# Altium project Accelerometer.PrjPcb
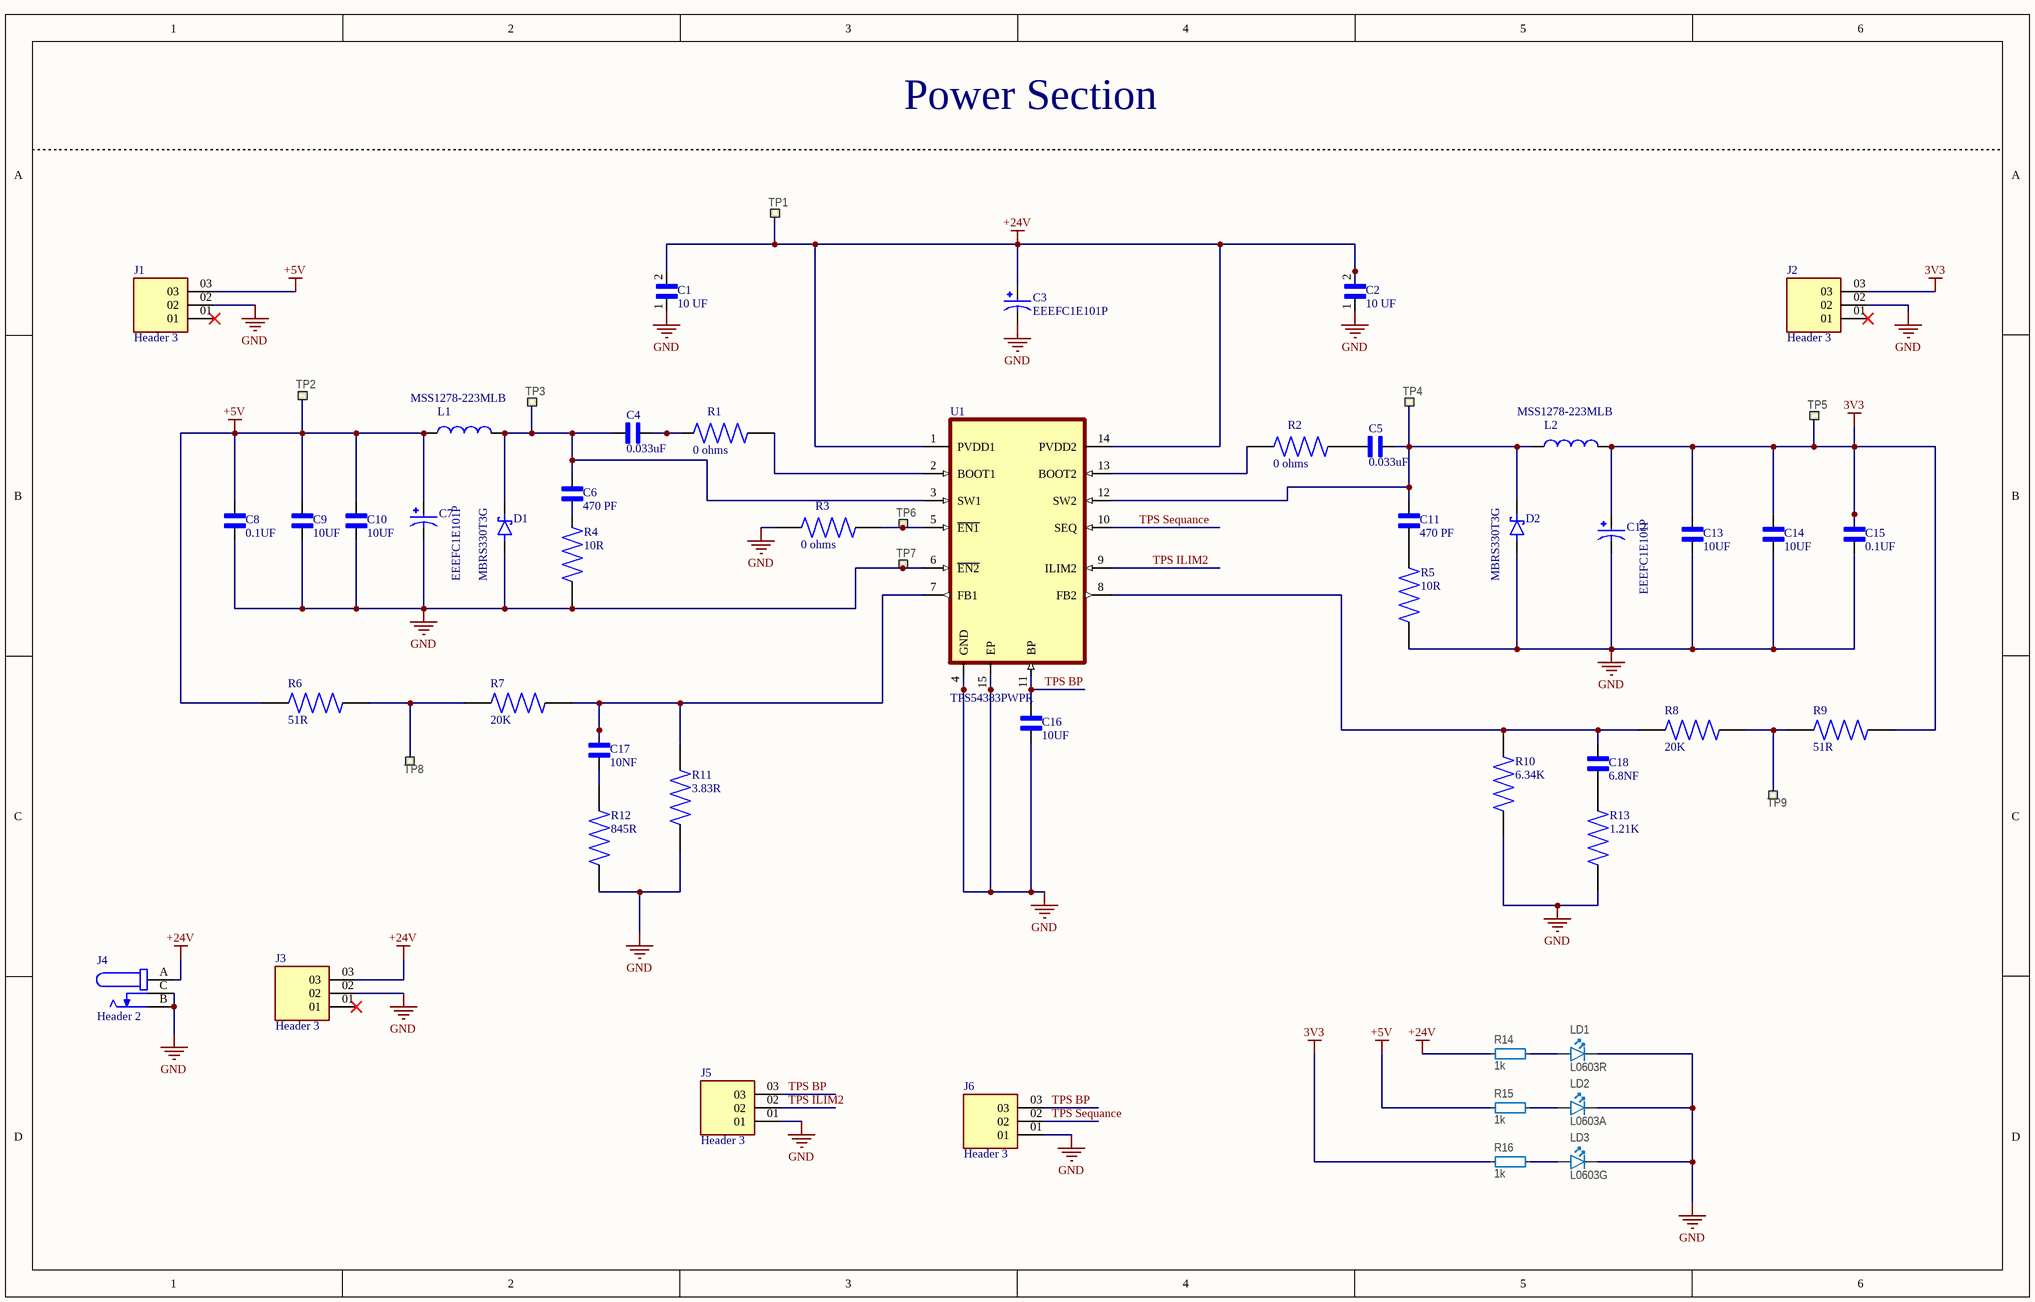
[diagram p0: Power section.SchDoc]
3 sheets, 128 parts. Net scope: global (net labels, ports and power ports of the same name join across sheets).
Board file: Accelero.PcbDoc
Sheets:
  Power section.SchDoc
  MCU.SchDoc
  Sheet1.SchDoc

## Sheet Power section.SchDoc
size 381 x 241 mm; SheetNumber: 1; SheetTotal: 3

### Parts
C1  10 UF  [CAPC3216X180N]
C2  10 UF  [CAPC3216X180N]
C3  EEEFC1E101P  [CAP_EEEFC1E101P]
C4  0.033uF  [CAPC1608X90]
C5  0.033uF  [CAPC1608X90]
C6  470 PF  [CAPC1608X90]
C7  EEEFC1E101P  [CAP_EEEFC1E101P]
C8  0.1UF  [CAPC1608X90]
C9  10UF  [CAPC2012X140N]
C10  10UF  [CAPC2012X140N]
C11  470 PF  [CAPC1608X90]
C12  EEEFC1E101P  [CAP_EEEFC1E101P]
C13  10UF  [CAPC2012X140N]
C14  10UF  [CAPC2012X140N]
C15  0.1UF  [CAPC1608X90]
C16  10UF  [CAPC2012X140N]
C17  10NF  [CAPC1608X90]
C18  6.8NF  [CAPC1608X90]
D1  MBRS330T3G  [DIOM7959X261N]
D2  MBRS330T3G  [DIOM7959X261N]
J1  Header 3  [SAMTEC_HMTSW-103-XX-X-S-XXX]
J2  Header 3  [SAMTEC_HMTSW-103-XX-X-S-XXX]
J3  Header 3  [SAMTEC_HMTSW-103-XX-X-S-XXX]
J4  Header 2  [TENSILITY_54-00129]
J5  Header 3  [SAMTEC_HMTSW-103-XX-X-S-XXX]
J6  Header 3  [SAMTEC_HMTSW-103-XX-X-S-XXX]
L1  MSS1278-223MLB  [IND_MSS1278-223MLB]
L2  MSS1278-223MLB  [IND_MSS1278-223MLB]
LD1  L0603R  [LED_0603_R]
LD2  L0603A  [LED_0603_Y]
LD3  L0603G  [LED_0603_G]
R1  0 ohms  [RESC1608X55N]
R2  0 ohms  [RESC1608X55N]
R3  0 ohms  [RESC1608X55N]
R4  10R  [RESC1608X55N]
R5  10R  [RESC1608X55N]
R6  51R  [RESC1608X55N]
R7  20K  [RESC1608X55N]
R8  20K  [RESC1608X55N]
R9  51R  [RESC1608X55N]
R10  6.34K  [RESC1608X55N]
R11  3.83R  [RESC1608X55N]
R12  845R  [RESC1608X55N]
R13  1.21K  [RESC1608X55N]
R14  1k  [RESC0603X03L_C]
R15  1k  [RESC0603X03L_C]
R16  1k  [RESC0603X03L_C]
TP1  Ø0.7mm,SMD  [TP_SMD_D0.7mm]  (value not drawn)  (no BOM)
TP2  Ø0.7mm,SMD  [TP_SMD_D0.7mm]  (value not drawn)  (no BOM)
TP3  Ø0.7mm,SMD  [TP_SMD_D0.7mm]  (value not drawn)  (no BOM)
TP4  Ø0.7mm,SMD  [TP_SMD_D0.7mm]  (value not drawn)  (no BOM)
TP5  Ø0.7mm,SMD  [TP_SMD_D0.7mm]  (value not drawn)  (no BOM)
TP6  Ø0.7mm,SMD  [TP_SMD_D0.7mm]  (value not drawn)  (no BOM)
TP7  Ø0.7mm,SMD  [TP_SMD_D0.7mm]  (value not drawn)  (no BOM)
TP8  Ø0.7mm,SMD  [TP_SMD_D0.7mm]  (value not drawn)  (no BOM)
TP9  Ø0.7mm,SMD  [TP_SMD_D0.7mm]  (value not drawn)  (no BOM)
U1  TPS54383PWPR  [IC_TPS27S100BPWPR]

### Nets
3V3: C12.1 C13.1 C14.1 C15.1 J2.03 L2.2 R9.1 R16.1 TP5.1
+5V: C7.1 C8.1 C9.1 C10.1 J1.03 L1.1 R6.2 R15.1 TP2.1
+24V: C1.2 C2.2 C3.1 J3.03 J4.A R14.1 TP1.1 U1.1(PVDD1) U1.14(PVDD2)
GND: C1.1 C2.1 C3.2 C7.2 C8.2 C9.2 C10.2 C12.2 C13.2 C14.2 C15.2 C16.2 D1.A D2.A J1.02 J2.02 J3.02 J4.B J4.C J5.01 J6.01 LD1.1(C) LD2.1(C) LD3.1(C) R3.1 R4.1 R5.1 R10.1 R11.1 R12.1 R13.1 TP7.1 U1.4(GND) U1.6(~{EN2}) U1.15(EP)
TPS BP: C16.1 J5.03 J6.03 U1.11(BP)
TPS ILIM2: J5.02 U1.9(ILIM2)
TPS Sequance: J6.02 U1.10(SEQ)
NetC4_1: C4.1 R1.1
NetC4_2: C4.2 C6.1 D1.C(K) L1.2 TP3.1 U1.3(SW1)
NetC5_1: C5.1 C11.1 D2.C(K) L2.1 TP4.1 U1.12(SW2)
NetC5_2: C5.2 R2.2
NetC6_2: C6.2 R4.2
NetC11_2: C11.2 R5.2
NetC17_1: C17.1 R7.1 R11.2 U1.7(FB1)
NetC17_2: C17.2 R12.2
NetC18_1: C18.1 R8.2 R10.2 U1.8(FB2)
NetC18_2: C18.2 R13.2
NetLD1_2: LD1.2(A) R14.2
NetLD2_2: LD2.2(A) R15.2
NetLD3_2: LD3.2(A) R16.2
NetR1_2: R1.2 U1.2(BOOT1)
NetR2_1: R2.1 U1.13(BOOT2)
NetR3_2: R3.2 TP6.1 U1.5(~{EN1})
NetR6_1: R6.1 R7.2 TP8.1
NetR8_1: R8.1 R9.2 TP9.1

Not connected (* = marked no-connect by the designer): J1 01*; J2 01*; J3 01*

### Notes on the sheet
- Power Section

### Library data of the parts
C1 C2 = C3216X5R1E106M160AB: 10µF Â±20% 25V Ceramic Capacitor 1206 (3216 Metric); MF: TDK; Check_prices: https://www.snapeda.com/parts/C3216X5R1E106M160AB/TDK/view-part/?ref=eda; Value: *; Digi-Key_Part_Number: 445-7708-2-ND; MP: C3216X5R1E106M160AB; Package: 3216 TDK; Purchase-URL: https://pricing.snapeda.com/search/part/C3216X5R1E106M160AB/?ref=eda; SnapEDA_Link: https://www.snapeda.com/parts/C3216X5R1E106M160AB/TDK/view-part/?ref=snap
C3 C7 C12 = EEEFC1E101P: Capacitor,Alum Electrolytic,Cap 100 uF,Tol 20%,Vol-Rtg 25 VDC,SMT,8x10.2,TR | Panasonic Electronic Components EEE-FC1E101P; SnapEDA_Link: https://www.snapeda.com/parts/EEE-FC1E101P/Panasonic+Electronic+Components/view-part/?ref=snap; Package: RADIAL-2 Panasonic; Value: *; MF: Panasonic; MP: EEE-FC1E101P; Check_prices: https://www.snapeda.com/parts/EEE-FC1E101P/Panasonic+Electronic+Components/view-part/?ref=eda
C4 C5 = C0603C104J3RACTU: Capacitor, ceramic, 25 V, X7R, 20%, .033 μF, 0603; MF: KEMET; SnapEDA_Link: https://www.snapeda.com/parts/C0603C104J3RACTU/KEMET/view-part/?ref=snap; Package: 603-2 KEMET; Value: *; MP: C0603C104J3RACTU; Check_prices: https://www.snapeda.com/parts/C0603C104J3RACTU/KEMET/view-part/?ref=eda
C6 C11 = C0603C104J3RACTU: Capacitor, ceramic, 25 V, X7R, 20%, 470 pF, 0603; MF: KEMET; SnapEDA_Link: https://www.snapeda.com/parts/C0603C104J3RACTU/KEMET/view-part/?ref=snap; Package: 603-2 KEMET; Value: *; MP: C0603C104J3RACTU; Check_prices: https://www.snapeda.com/parts/C0603C104J3RACTU/KEMET/view-part/?ref=eda
C8 C15 = C0603C104J3RACTU: Capacitor, ceramic, 10 V, X7R, 20%, 0.1 μF, 0603; MF: KEMET; SnapEDA_Link: https://www.snapeda.com/parts/C0603C104J3RACTU/KEMET/view-part/?ref=snap; Package: 603-2 KEMET; Value: *; MP: C0603C104J3RACTU; Check_prices: https://www.snapeda.com/parts/C0603C104J3RACTU/KEMET/view-part/?ref=eda
C9 C10 C13 C14 = 0805ZD474MAT2A: Capacitor, ceramic, 6.3 V, X5R, 20%, 10 μF, 0805; MF: AVX; SnapEDA_Link: https://www.snapeda.com/parts/0805ZD474MAT2A/AVX/view-part/?ref=snap; Package: 0805-2 AVX; Value: *; MP: 0805ZD474MAT2A; Check_prices: https://www.snapeda.com/parts/0805ZD474MAT2A/AVX/view-part/?ref=eda
C16 = 0805ZD474MAT2A: 0.47 ÂµF Â±20% 10V Ceramic Capacitor X5R 0805 (2012 Metric); MF: AVX; SnapEDA_Link: https://www.snapeda.com/parts/0805ZD474MAT2A/AVX/view-part/?ref=snap; Package: 0805-2 AVX; Value: *; MP: 0805ZD474MAT2A; Check_prices: https://www.snapeda.com/parts/0805ZD474MAT2A/AVX/view-part/?ref=eda
C17 C18 = C0603C104J3RACTU: 0603 C 100nF Ceramic Multilayer Capacitor, 25 V, +125degC, X7R Dielectric, +/-5% | KEMET C0603C104J3RACTU; SnapEDA_Link: https://www.snapeda.com/parts/C0603C104J3RACTU/KEMET/view-part/?ref=snap; Package: 603-2 KEMET; Value: *; MF: KEMET; MP: C0603C104J3RACTU; Check_prices: https://www.snapeda.com/parts/C0603C104J3RACTU/KEMET/view-part/?ref=eda
D1 D2 = MBRS330T3G: Diode Schottky 30 V 3A Surface Mount SMC; MF: ON Semiconductor; SnapEDA_Link: https://www.snapeda.com/parts/MBRS330T3G/Onsemi/view-part/?ref=snap; Package: SMC-2 ON Semiconductor; Value: *; MP: MBRS330T3G; Check_prices: https://www.snapeda.com/parts/MBRS330T3G/Onsemi/view-part/?ref=eda
J1-J3 J5 J6 = HMTSW-103-XX-X-S-XXX: Connector Unshrouded Header 3 Position 2.54mm Solder Straight Through Hole; MF: Samtec; MP: HMTSW-103-10-T-S-330; SnapEDA_Link: https://www.snapeda.com/parts/HMTSW-103-10-T-S-330/Samtec/view-part/?ref=snap; Package: None; Value: *; Check_prices: https://www.snapeda.com/parts/HMTSW-103-10-T-S-330/Samtec/view-part/?ref=eda
J4 = 54-00129: Connector, dc jack 5.5x2.1 mm, PCB mount, 90 degrees, silver plated, thru hole; MF: Tensility International Corp; Package: None; Price: None; Check_prices: https://www.snapeda.com/parts/54-00129/Tensility+International+Corp/view-part/?ref=eda; Value: *; SnapEDA_Link: https://www.snapeda.com/parts/54-00129/Tensility+International+Corp/view-part/?ref=snap; MP: 54-00129; Availability: In Stock; Purchase-URL: https://pricing.snapeda.com/search?q=54-00129&ref=eda
L1 L2 = MSS1278-223MLB: Fixed Inductors 22uH Shld 20% 4A 39.5mOhms AECQ2; MF: Coilcraft; SnapEDA_Link: https://www.snapeda.com/parts/MSS1278-223MLB/Coilcraft/view-part/?ref=snap; Package: None; Value: *; MP: MSS1278-223MLB; Check_prices: https://www.snapeda.com/parts/MSS1278-223MLB/Coilcraft/view-part/?ref=eda
LD1 = ASMT-RR45-AQ902: LED, Red, 0603, Vf=2V, - 40 to +100°C; Manufacturer: Avago; Part number NEMS: 101400008; Component Status: Active; Pad Count: 2; Note: 90 mcd @ 20 mA; Artikkelnr Noca: N.A.; Part Number: ASMT-RR45-AQ902; PartId: 101400008; Component Class: Optoelectronics; Author: rsk; Manufacturer Part Number: ASMT-RR45-AQ902; ComponentLink1URL: N.A.; ComponentLink1Description: Datasheet; ComponentLink2URL: N.A.; ComponentLink2Description: Supplier link; HelpURL: http://www.avagotech.com/docs/AV02-0378EN; LatestRevisionDate: 2015-06-12; Published: 2015-06-12; Footprint Doc: 0603; Value: L0603R; Supplier 1: Digi-Key; Supplier Part Number 1: 516-2005-1-ND; Supplier 2: Mouser; Supplier Part Number 2: 630-ASMT-RR45-AQ902; Part number IPS: N.A.; Part number Norautron: N.A.
LD2 = ASMT-RA45-AP932: LED, Amber, 0603,  Vf=2V, - 40 to +100°C; Manufacturer: Avago; Part number NEMS: 101400011; Component Status: Active; Pad Count: 2; Note: 57 mcd @ 20 mA; Artikkelnr Noca: N.A.; Part Number: ASMT-RA45-AP932; PartId: 101400011; Component Class: Optoelectronics; Author: rsk; Manufacturer Part Number: ASMT-RA45-AP932; ComponentLink1URL: N.A.; ComponentLink1Description: Datasheet; ComponentLink2URL: N.A.; ComponentLink2Description: Supplier link; HelpURL: http://www.avagotech.com/docs/AV02-0378EN; LatestRevisionDate: 2015-06-12; Published: 2015-06-12; Footprint Doc: 0603; Value: L0603A; Supplier 1: N.A.; Supplier Part Number 1: N.A.; Supplier 2: Mouser; Supplier Part Number 2: 630-ASMT-RA45-AP932; Part number IPS: N.A.; Part number Norautron: N.A.
LD3 = ASMT-RF45-AN002: LED, Yellow Green, 0603, Vf=2V, - 40 to +100°C; Manufacturer: Avago; Part number NEMS: 101400010; Component Status: Active; Pad Count: 2; Note: 28 mcd @ 20 mA; Artikkelnr Noca: N.A.; Part Number: ASMT-RF45-AN002; PartId: 101400010; Component Class: Optoelectronics; Author: rsk; Manufacturer Part Number: ASMT-RF45-AN002; ComponentLink1URL: N.A.; ComponentLink1Description: Datasheet; ComponentLink2URL: N.A.; ComponentLink2Description: Supplier link; HelpURL: http://www.avagotech.com/docs/AV02-0378EN; LatestRevisionDate: 2015-06-12; Published: 2015-06-12; Footprint Doc: 0603; Value: L0603G; Supplier 1: Digi-Key; Supplier Part Number 1: 516-2522-1-ND; Supplier 2: Mouser; Supplier Part Number 2: 630-ASMT-RF45-AN002; Part number IPS: N.A.; Part number Norautron: N.A.
R1-R3 = RC0603JR-0751RL: Resistor, chip, 1/16 W, 5%, 0 Ω, 0603; MF: Yageo; SnapEDA_Link: https://www.snapeda.com/parts/RC0603JR-0751RL/Yageo/view-part/?ref=snap; Package: 1608 Yageo; Value: *; MP: RC0603JR-0751RL; Check_prices: https://www.snapeda.com/parts/RC0603JR-0751RL/Yageo/view-part/?ref=eda
R4 R5 = RC0603JR-0751RL: Resistor, chip, 1/16 W, 5%, 10 Ω, 0603; MF: Yageo; SnapEDA_Link: https://www.snapeda.com/parts/RC0603JR-0751RL/Yageo/view-part/?ref=snap; Package: 1608 Yageo; Value: *; MP: RC0603JR-0751RL; Check_prices: https://www.snapeda.com/parts/RC0603JR-0751RL/Yageo/view-part/?ref=eda
R6-R13 = RC0603JR-0751RL: 51 Ohms Â±5% 0.1W, 1/10W Chip Resistor 0603 (1608 Metric) Moisture Resistant Thick Film; MF: Yageo; SnapEDA_Link: https://www.snapeda.com/parts/RC0603JR-0751RL/Yageo/view-part/?ref=snap; Package: 1608 Yageo; Value: *; MP: RC0603JR-0751RL; Check_prices: https://www.snapeda.com/parts/RC0603JR-0751RL/Yageo/view-part/?ref=eda
R14-R16 = R0201-1k0: Resistor, ±1%, 0.05W; Manufacturer: N.A.; Part number IPS: 00000005786; Part number NEMS: 100100043; Component Status: Active; Pad Count: 2; Note: Chip Res 1%; Part Number: R0201-1k0; PartId: 100100043; Component Class: Resistors; Author: rsk; Manufacturer Part Number: N.A.; ComponentLink1URL: N.A.; ComponentLink1Description: Datasheet; ComponentLink2URL: N.A.; ComponentLink2Description: Supplier link; HelpURL: N.A.; LatestRevisionDate: 2014-11-13; Published: 2014-11-13; Footprint Doc: 0201; Value: 1k; Supplier 1: N.A.; Supplier Part Number 1: N.A.; Supplier 2: N.A.; Supplier Part Number 2: N.A.; Artikkelnr Noca: N.A.; Part number Norautron: N.A.
TP1-TP9 = TP_SMD_Ø0.7MM: 0.7mm circular SMD testpad; Manufacturer: Nordic Semiconductor; Manufacturer Part Number: N.A.; Part number NEMS: 100500474; Component Status: Active; Pad Count: 1; System: Connector; Part Number: TP_SMD_Ø0.7MM; PartId: 100500474; Component Class: Connectors; Author: rsk; ComponentLink1URL: N.A.; ComponentLink1Description: Datasheet; ComponentLink2URL: N.A.; ComponentLink2Description: Supplier link; HelpURL: N.A.; LatestRevisionDate: 2021-03-05; Published: 2017-12-14; Footprint Doc: TP_SMD_Ø0.7mm; Value: Ø0.7mm,SMD; Note: N.A.; Supplier 1: N.A.; Supplier Part Number 1: N.A.; Supplier 2: N.A.; Supplier Part Number 2: N.A.; Artikkelnr Noca: N.A.; Part number IPS: N.A.; Part number Norautron: N.A.
U1 = TPS54383PWPR: MF: {'manufacturer': u'Texas Instruments'}; Package: None; Price: None; Value: *; MP: TPS54383PWPR; Availability: Unavailable

## Sheet MCU.SchDoc
size 381 x 241 mm; SheetNumber: 2; SheetTotal: 3
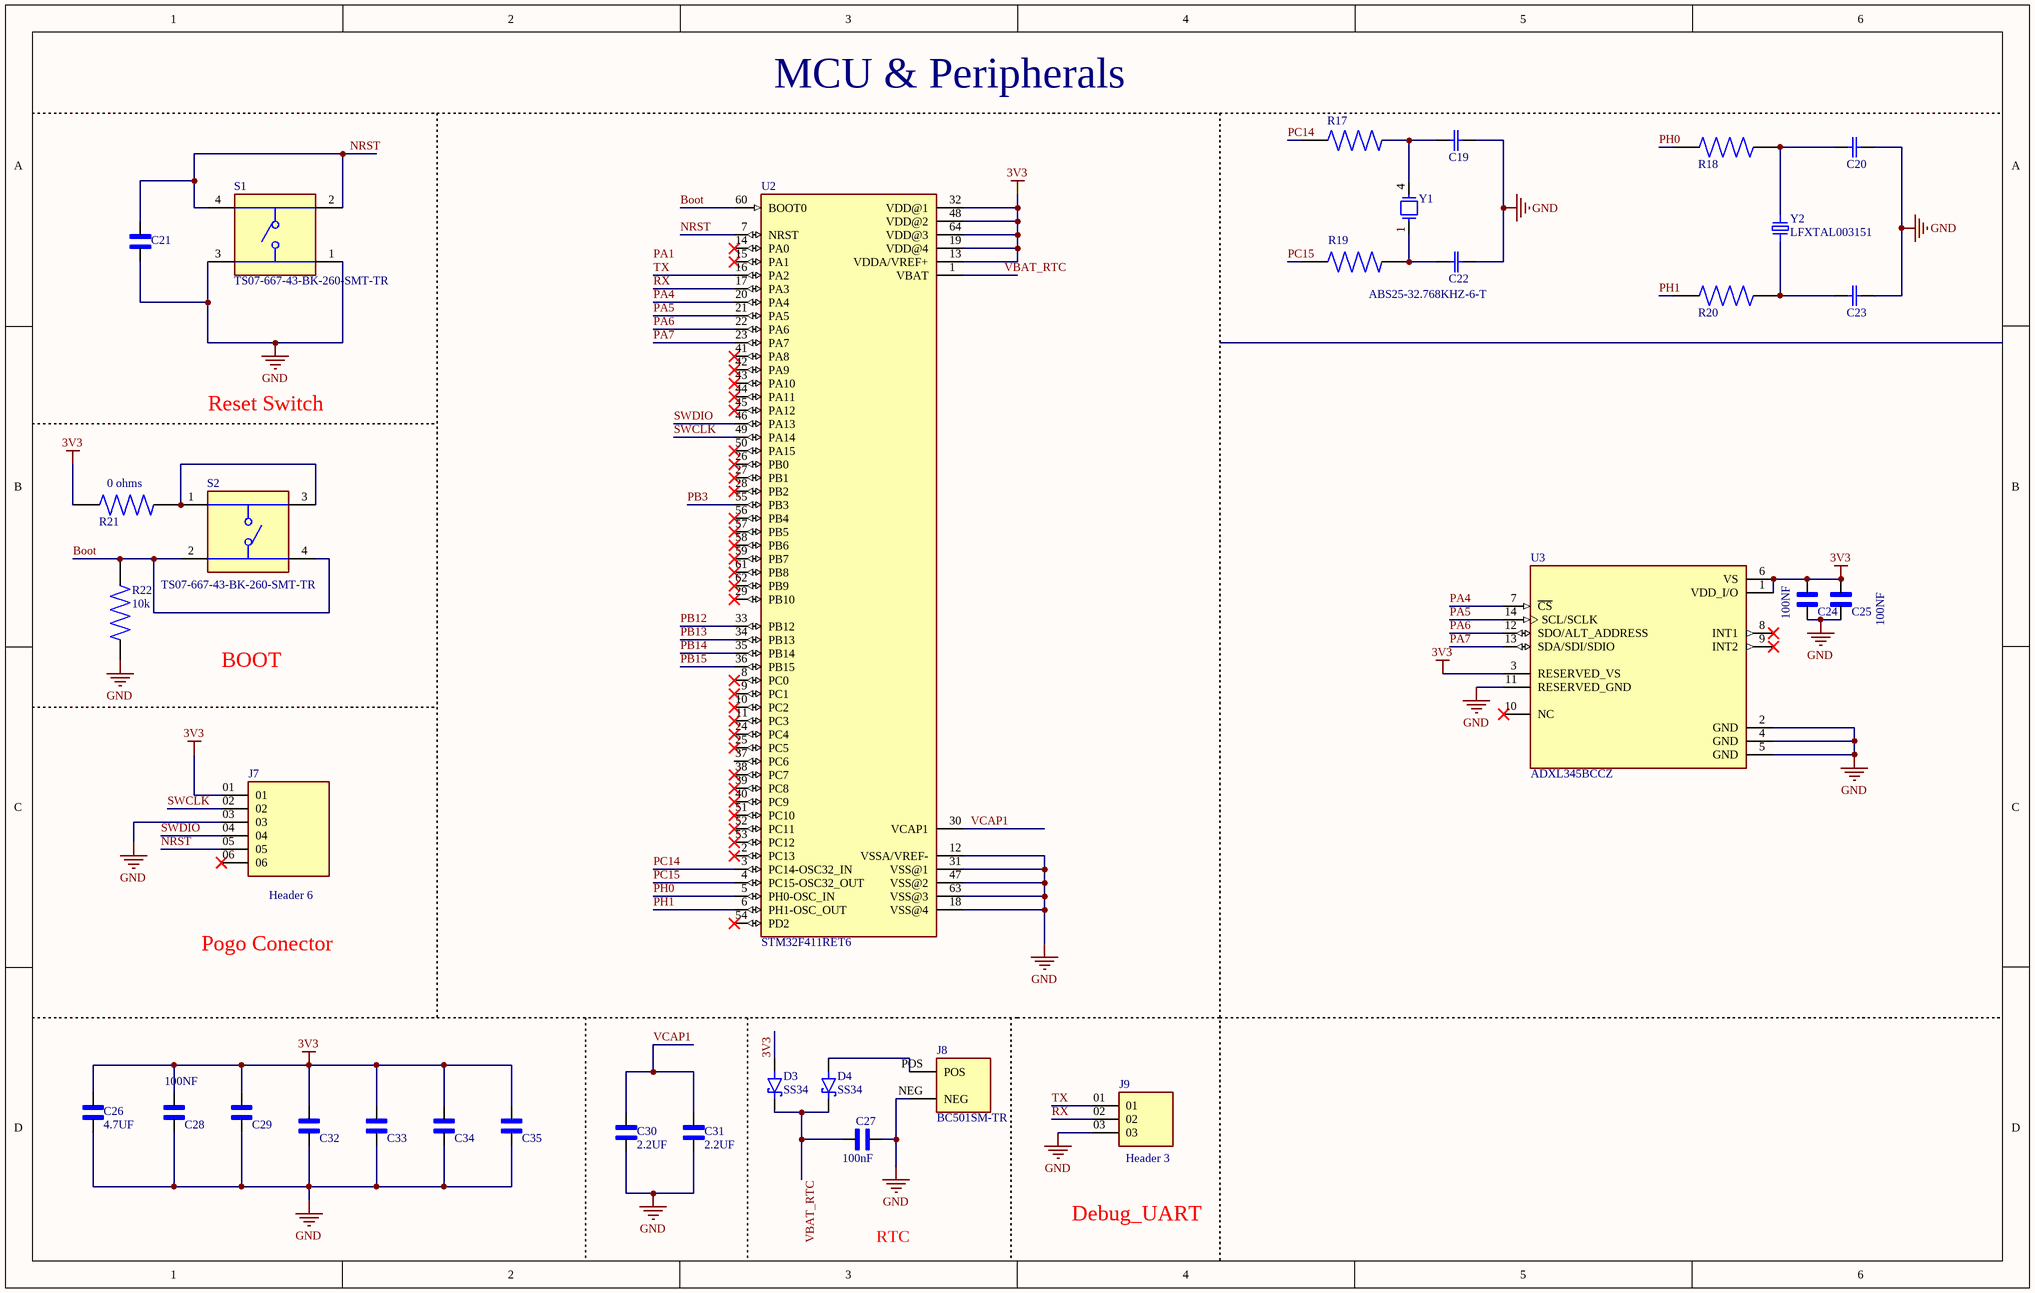
[diagram p1: MCU.SchDoc]

### Parts
C19  C0603C200J5GACTU  [CAPC1608X85N]  (value not drawn)
C20  C0603C200J5GACTU  [CAPC1608X85N]  (value not drawn)
C21  C0603C104J3RACTU  [CAPC1608X90]  (value not drawn)
C22  C0603C200J5GACTU  [CAPC1608X85N]  (value not drawn)
C23  C0603C200J5GACTU  [CAPC1608X85N]  (value not drawn)
C24  100NF  [CAPC1608X90]
C25  100NF  [CAPC1608X90]
C26  4.7UF  [CAPC2012X135N]
C27  100nF  [CAPC1608X90]
C28  100NF  [CAPC1608X90]
C29  C0603C104J3RACTU  [CAPC1608X90]  (value not drawn)
C30  2.2UF  [CAPC2012X135N]
C31  2.2UF  [CAPC2012X135N]
C32  C0603C104J3RACTU  [CAPC1608X90]  (value not drawn)
C33  C0603C104J3RACTU  [CAPC1608X90]  (value not drawn)
C34  C0603C104J3RACTU  [CAPC1608X90]  (value not drawn)
C35  C0603C104J3RACTU  [CAPC1608X90]  (value not drawn)
D3  SS34  [DIO_SS34]
D4  SS34  [DIO_SS34]
J7  Header 6  [SAMTEC_MTLW-106-06-G-S-180]
J8  BC501SM-TR  [MPD_BC501SM-TR]
J9  Header 3  [SAMTEC_HMTSW-103-XX-X-S-XXX]
R17  AC1206FR-070RL  [RESC3116X65N]  (value not drawn)
R18  AC1206FR-070RL  [RESC3116X65N]  (value not drawn)
R19  AC1206FR-070RL  [RESC3116X65N]  (value not drawn)
R20  AC1206FR-070RL  [RESC3116X65N]  (value not drawn)
R21  0 ohms  [RESC3116X65N]
R22  10k  [RESC2012X60N]
S1  TS07-667-43-BK-260-SMT-TR  [SW_TS07-667-43-BK-260-SMT-TR]
S2  TS07-667-43-BK-260-SMT-TR  [SW_TS07-667-43-BK-260-SMT-TR]
U2  STM32F411RET6  [QFP50P1200X1200X160-64N]
U3  ADXL345BCCZ  [IC_ADXL345BCCZ]
Y1  ABS25-32.768KHZ-6-T  [XTAL_ABS25-32.768KHZ-6-T]
Y2  LFXTAL003151  [WE-XTAL_HC49/4HSMX]

### Nets
3V3: C24.2 C25.2 C26.1 C28.2 C29.2 C32.2 C33.2 C34.2 C35.2 D3.A J7.01 R21.2 U2.13(VDDA/VREF+) U2.19(VDD@4) U2.32(VDD@1) U2.48(VDD@2) U2.64(VDD@3) U3.1(VDD_I/O) U3.3(RESERVED_VS) U3.6(VS)
GND: C19.2(C2) C20.1(C1) C21.2 C22.1(C1) C23.2(C2) C24.1 C25.1 C26.2 C27.1 C28.1 C29.1 C30.2 C31.2 C32.1 C33.1 C34.1 C35.1 J7.03 J8.NEG J9.03 S1.1 S1.3 U2.12(VSSA/VREF-) U2.18(VSS@4) U2.31(VSS@1) U2.47(VSS@2) U2.63(VSS@3) U3.2(GND) U3.4(GND) U3.5(GND) U3.11(RESERVED_GND)
Boot: R22.2 S2.2 S2.4 U2.60(BOOT0)
NRST: C21.1 J7.05 S1.2 S1.4 U2.7(NRST)
PA4: U2.20(PA4) U3.7(~{CS})
PA5: U2.21(PA5) U3.14(SCL/SCLK)
PA6: U2.22(PA6) U3.12(SDO/ALT_ADDRESS)
PA7: U2.23(PA7) U3.13(SDA/SDI/SDIO)
PB3: U2.55(PB3)
PB12: U2.33(PB12)
PB13: U2.34(PB13)
PB14: U2.35(PB14)
PB15: U2.36(PB15)
PC14: R17.1 U2.3(PC14-OSC32_IN)
PC15: R19.1 U2.4(PC15-OSC32_OUT)
PH0: R18.1 U2.5(PH0-OSC_IN)
PH1: R20.1 U2.6(PH1-OSC_OUT)
RX: J9.02 U2.17(PA3)
SWCLK: J7.02 U2.49(PA14)
SWDIO: J7.04 U2.46(PA13)
TX: J9.01 U2.16(PA2)
VBAT_RTC: C27.2 D3.C(K) D4.C(K) U2.1(VBAT)
VCAP1: C30.1 C31.1 U2.30(VCAP1)
NetC19_1: C19.1(C1) R17.2 Y1.4
NetC20_2: C20.2(C2) R18.2 Y2.2
NetC22_2: C22.2(C2) R19.2 Y1.1
NetC23_1: C23.1(C1) R20.2 Y2.1
NetD4_A: D4.A J8.POS
NetR21_1: R21.1 S2.1 S2.3

Not connected (* = marked no-connect by the designer): J7 06*; R22 1; U2 2(PC13)* 8(PC0)* 9(PC1)* 10(PC2)* 11(PC3)* 14(PA0)* 15(PA1)* 24(PC4)* 25(PC5)* 26(PB0)* 27(PB1)* 28(PB2)* 29(PB10)* 37(PC6) 38(PC7)* 39(PC8)* 40(PC9)* 41(PA8)* 42(PA9)* 43(PA10)* 44(PA11)* 45(PA12)* 50(PA15)* 51(PC10)* 52(PC11)* 53(PC12)* 54(PD2)* 56(PB4)* 57(PB5)* 58(PB6)* 59(PB7)* 61(PB8)* 62(PB9)*; U3 8(INT1)* 9(INT2)* 10(NC)*

### Notes on the sheet
- MCU & Peripherals
- Reset Switch
- BOOT
- Pogo Conector
- RTC
- Debug_UART
- Labels drawn without touching a wire or pin: GND, PA1

### Library data of the parts
C19 C20 C22 C23 = C0603C200J5GACTU: Capacitor Ceramic C0G 0603 50V 20pF | KEMET C0603C200J5GACTU; SnapEDA_Link: https://www.snapeda.com/parts/C0603C200J5GACTU/KEMET/view-part/?ref=snap; Package: 0603 Kemet; Value: *; MF: KEMET; MP: C0603C200J5GACTU; Check_prices: https://www.snapeda.com/parts/C0603C200J5GACTU/KEMET/view-part/?ref=eda
C21 C24 C25 C27-C29 C32-C35 = C0603C104J3RACTU: as C17 on sheet Power section; SnapEDA_Link: https://www.snapeda.com/parts/C0603C104J3RACTU/KEMET/view-part/?ref=snap; Package: 603-2 KEMET; Value: *; MF: KEMET; MP: C0603C104J3RACTU; Check_prices: https://www.snapeda.com/parts/C0603C104J3RACTU/KEMET/view-part/?ref=eda
C26 C30 C31 = CL21B225KPFNNNG: 2.2 ÂµF Â±10% 10V Ceramic Capacitor X7R 0805 (2012 Metric); MF: Samsung; SnapEDA_Link: https://www.snapeda.com/parts/CL21B225KPFNNNG/Samsung/view-part/?ref=snap; Package: SMD-2 Samsung; Value: *; MP: CL21B225KPFNNNG; Check_prices: https://www.snapeda.com/parts/CL21B225KPFNNNG/Samsung/view-part/?ref=eda
D3 D4 = SS34: 3A, 40V, Schottky Rectifier; MF: Taiwan Semiconductor; SnapEDA_Link: https://www.snapeda.com/parts/SS34/taiwan/view-part/?ref=snap; Package: DO-214AB-2 Taiwan Semiconductor; Value: *; MP: SS34; Check_prices: https://www.snapeda.com/parts/SS34/taiwan/view-part/?ref=eda
J7 = MTLW-106-06-G-S-180: Package: None; MP: MTLW-106-06-G-S-180; Price: None; Availability: Unavailable; Value: *
J8 = BC501SM-TR: Battery Holder (Open) Coin, 12.0mm 1 Cell SMD (SMT) Tab; MF: MPD (Memory; SnapEDA_Link: https://www.snapeda.com/parts/BC501SM-TR/MPD/view-part/?ref=snap; Package: DFN-8 MPD; Value: *; MP: BC501SM-TR; Check_prices: https://www.snapeda.com/parts/BC501SM-TR/MPD/view-part/?ref=eda
J9 = HMTSW-103-XX-X-S-XXX: as J1 on sheet Power section; SnapEDA_Link: https://www.snapeda.com/parts/HMTSW-103-10-T-S-330/Samtec/view-part/?ref=snap; Package: None; Value: *; Check_prices: https://www.snapeda.com/parts/HMTSW-103-10-T-S-330/Samtec/view-part/?ref=eda
R17-R21 = AC1206FR-070RL: 0 Ohms Jumper Chip Resistor 1206 (3216 Metric) Automotive AEC-Q200 Thick Film; MF: Yageo; SnapEDA_Link: https://www.snapeda.com/parts/AC1206FR-070RL/Yageo/view-part/?ref=snap; Package: SMD-2 Yageo; Value: *; MP: AC1206FR-070RL; Check_prices: https://www.snapeda.com/parts/AC1206FR-070RL/Yageo/view-part/?ref=eda
R22 = CR0805-JW-331ELF: Res 0805 330R 5% 125mW | Bourns CR0805-JW-331ELF; SnapEDA_Link: https://www.snapeda.com/parts/CR0805-JW-331ELF/Bourns/view-part/?ref=snap; Package: 0805 Bourns; Value: *; MF: Bourns; MP: CR0805-JW-331ELF; Check_prices: https://www.snapeda.com/parts/CR0805-JW-331ELF/Bourns/view-part/?ref=eda
S1 S2 = TS07-667-43-BK-260-SMT-TR: 6 x 6.7 mm, 4.3 mm Actuator Height, 260 gf, Black, Surface Mount, SPST, Tactile Switch; MF: Same Sky; SnapEDA_Link: https://www.snapeda.com/parts/TS07-667-43-BK-260-SMT-TR/Same+Sky/view-part/?ref=snap; Package: None; Value: *; MP: TS07-667-43-BK-260-SMT-TR; Check_prices: https://www.snapeda.com/parts/TS07-667-43-BK-260-SMT-TR/Same+Sky/view-part/?ref=eda
U2 = STM32F411RET6: ARMÂ® CortexÂ®-M4 STM32F4 Mikrodenetleyici IC 32-Bit Tek Ã‡ekirdek 100MHz 512KB (512K x 8) FLASH 64-LQFP (10x10); MF: STMicroelectronics; SnapEDA_Link: https://www.snapeda.com/parts/STM32F411RET6/STMicroelectronics/view-part/?ref=snap; Package: LQFP-64 STMicroelectronics; Value: *; MP: STM32F411RET6; Check_prices: https://www.snapeda.com/parts/STM32F411RET6/STMicroelectronics/view-part/?ref=eda
U3 = ADXL345BCCZ: 3-Axis, Â±2 g/Â±4 g/Â±8 g/Â±16 g Digital Accelerometer; MF: Analog Devices; SnapEDA_Link: https://www.snapeda.com/parts/ADXL345BCCZ/Analog+Devices/view-part/?ref=snap; Package: LGA -14 Analog Devices; Value: *; MP: ADXL345BCCZ; Check_prices: https://www.snapeda.com/parts/ADXL345BCCZ/Analog+Devices/view-part/?ref=eda
Y1 = ABS25-32.768KHZ-6-T: 32.768 kHz Â±20ppm Crystal 6pF 50 kOhms 4-SOJ, 5.50mm pitch; MF: Abracon; SnapEDA_Link: https://www.snapeda.com/parts/ABS25-32.768KHZ-6-T/Abracon/view-part/?ref=snap; Package: 4-4 Abracon; Value: *; MP: ABS25-32.768KHZ-6-T; Check_prices: https://www.snapeda.com/parts/ABS25-32.768KHZ-6-T/Abracon/view-part/?ref=eda
Y2 = LFXTAL003151: 8 MHz Â±30ppm Crystal 16pF 40 Ohms HC-49/US; MF: IQD Frequency Products; SnapEDA_Link: https://www.snapeda.com/parts/LFXTAL003151/IQD+Frequency+Products/view-part/?ref=snap; Package: HC-49/US IQD Frequency Products; Value: *; MP: LFXTAL003151; Check_prices: https://www.snapeda.com/parts/LFXTAL003151/IQD+Frequency+Products/view-part/?ref=eda

## Sheet Sheet1.SchDoc
size A4; SheetNumber: 3; SheetTotal: 3
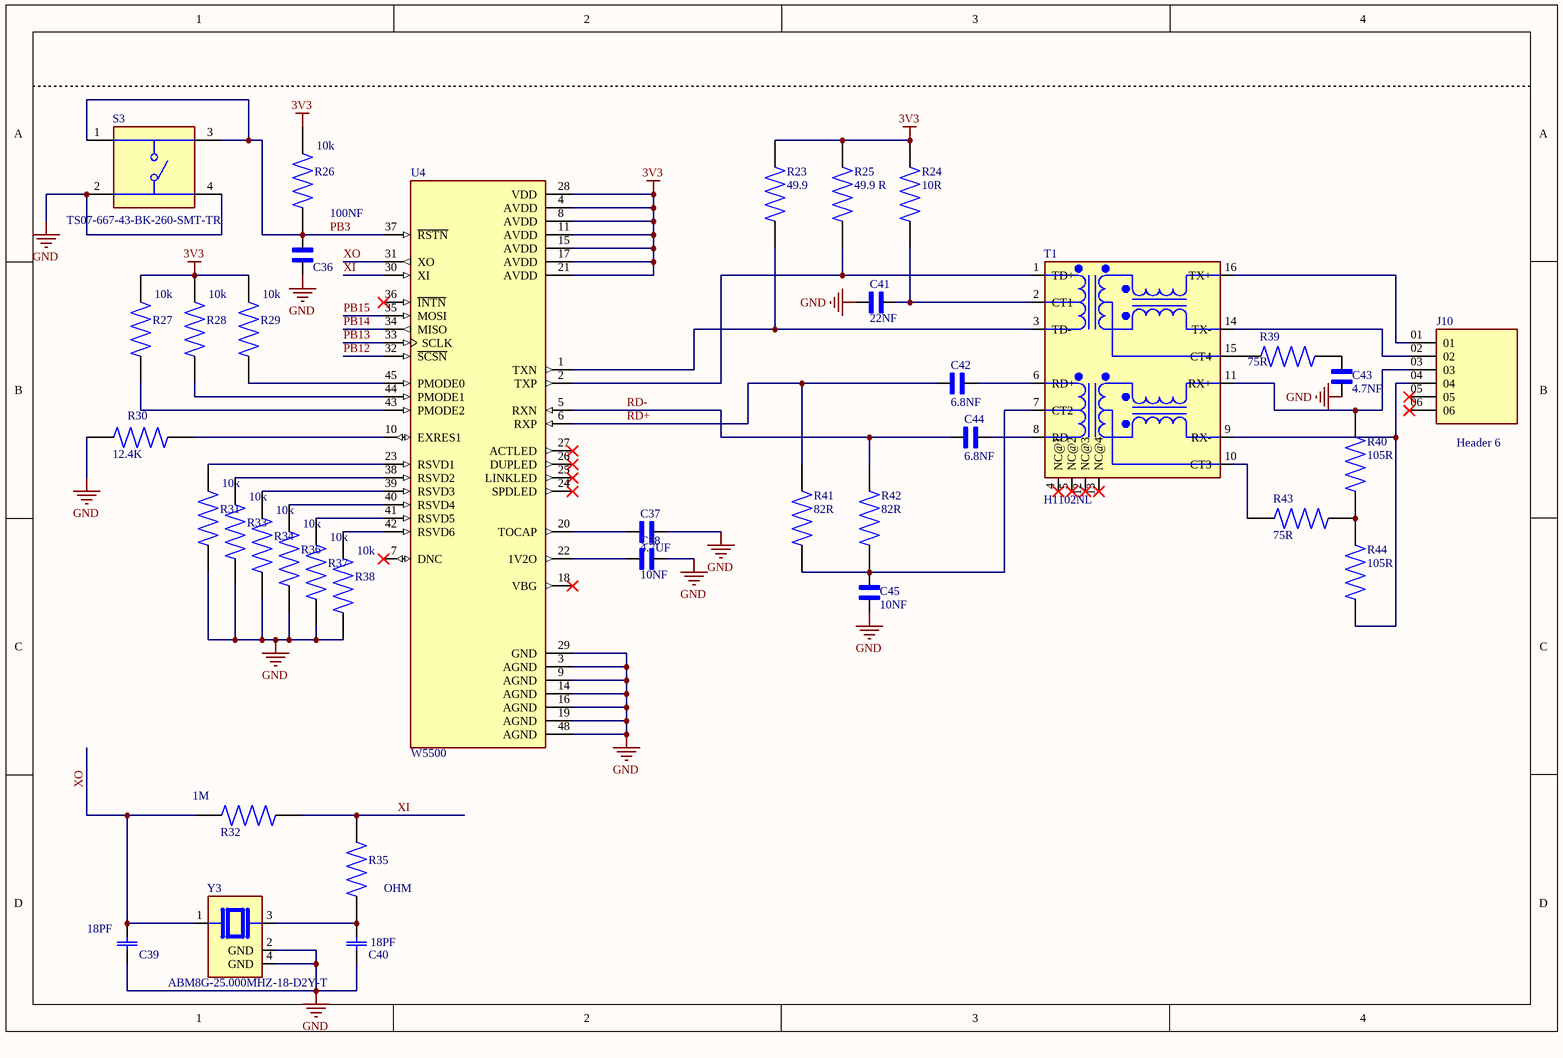
[diagram p2: Sheet1.SchDoc]

### Parts
C36  100NF  [CAPC1608X90]
C37  4.7UF  [CAPC2012X135N]
C38  10NF  [CAPC1608X90]
C39  18PF  [CAPC1608X85N]
C40  18PF  [CAPC1608X85N]
C41  22NF  [CAPC1608X90]
C42  6.8NF  [CAPC1608X90]
C43  4.7NF  [CAPC1608X90]
C44  6.8NF  [CAPC1608X90]
C45  10NF  [CAPC1608X90]
J10  Header 6  [SAMTEC_MTLW-106-06-G-S-180]
R23  49.9  [RESC3116X65N]
R24  10R  [RESC3116X65N]
R25  49.9 R  [RESC3116X65N]
R26  10k  [RESC3116X65N]
R27  10k  [RESC3116X65N]
R28  10k  [RESC3116X65N]
R29  10k  [RESC3116X65N]
R30  12.4K  [RESC3116X65N]
R31  10k  [RESC3116X65N]
R32  1M  [RESC3116X65N]
R33  10k  [RESC3116X65N]
R34  10k  [RESC3116X65N]
R35  OHM  [RESC3116X65N]
R36  10k  [RESC3116X65N]
R37  10k  [RESC3116X65N]
R38  10k  [RESC3116X65N]
R39  75R  [RESC3116X65N]
R40  105R  [RESC3116X65N]
R41  82R  [RESC3116X65N]
R42  82R  [RESC3116X65N]
R43  75R  [RESC3116X65N]
R44  105R  [RESC3116X65N]
S3  TS07-667-43-BK-260-SMT-TR  [SW_TS07-667-43-BK-260-SMT-TR]
T1  H1102NL  [H1102NL]
U4  W5500  [QFP50P900X900X160-48N]
Y3  ABM8G-25.000MHZ-18-D2Y-T  [XTAL_ABM8G-25.000MHZ-18-D2Y-T]

### Nets
3V3: R23.1 R24.1 R25.1 R26.2 R27.2 R28.2 R29.2 U4.4(AVDD) U4.8(AVDD) U4.11(AVDD) U4.15(AVDD) U4.17(AVDD) U4.21(AVDD) U4.28(VDD)
GND: C36.1 C37.2 C38.1 C39.1(C1) C40.1(C1) C41.2 C43.2 C45.2 R30.2 R31.1 R33.1 R34.1 R36.1 R37.1 R38.1 S3.2 S3.4 U4.3(AGND) U4.9(AGND) U4.14(AGND) U4.16(AGND) U4.19(AGND) U4.29(GND) U4.48(AGND) Y3.2(GND) Y3.4(GND)
PB3: C36.2 R26.1 S3.1 S3.3 U4.37(~{RSTN})
PB12: U4.32(~{SCSN})
PB13: U4.33(SCLK)
PB14: U4.34(MISO)
PB15: U4.35(MOSI)
RD+: C42.2 R41.1 U4.6(RXP)
RD-: C44.2 R42.1 U4.5(RXN)
XI: R32.1 R35.2 U4.30(XI)
XO: C39.2(C2) R32.2 U4.31(XO) Y3.1
NetC37_1: C37.1 U4.20(TOCAP)
NetC38_2: C38.2 U4.22(1V2O)
NetC40_2: C40.2(C2) R35.1 Y3.3
NetC41_1: C41.1 R24.2 T1.2(CT1)
NetC42_1: C42.1 T1.6(RD+)
NetC43_1: C43.1 R39.2
NetC44_1: C44.1 T1.8(RD-)
NetC45_1: C45.1 R41.2 R42.2 T1.7(CT2)
NetJ10_01: J10.01 T1.16(TX+)
NetJ10_02: J10.02 T1.14(TX-)
NetJ10_03: J10.03 R40.1 T1.11(RX+)
NetJ10_04: J10.04 R44.2 T1.9(RX-)
NetR23_2: R23.2 T1.3(TD-) U4.1(TXN)
NetR25_2: R25.2 T1.1(TD+) U4.2(TXP)
NetR27_1: R27.1 U4.43(PMODE2)
NetR28_1: R28.1 U4.44(PMODE1)
NetR29_1: R29.1 U4.45(PMODE0)
NetR30_1: R30.1 U4.10(EXRES1)
NetR31_2: R31.2 U4.23(RSVD1)
NetR33_2: R33.2 U4.38(RSVD2)
NetR34_2: R34.2 U4.39(RSVD3)
NetR36_2: R36.2 U4.40(RSVD4)
NetR37_2: R37.2 U4.41(RSVD5)
NetR38_2: R38.2 U4.42(RSVD6)
NetR39_1: R39.1 T1.15(CT4)
NetR40_2: R40.2 R43.2 R44.1
NetR43_1: R43.1 T1.10(CT3)

Not connected (* = marked no-connect by the designer): J10 05* 06*; T1 4(NC@1)* 5(NC@2)* 12(NC@3)* 13(NC@4)*; U4 7(DNC)* 18(VBG)* 24(SPDLED)* 25(LINKLED)* 26(DUPLED)* 27(ACTLED)* 36(~{INTN})*

### Library data of the parts
C36 C38 C41-C45 = C0603C104J3RACTU: as C17 on sheet Power section; SnapEDA_Link: https://www.snapeda.com/parts/C0603C104J3RACTU/KEMET/view-part/?ref=snap; Package: 603-2 KEMET; Value: *; MF: KEMET; MP: C0603C104J3RACTU; Check_prices: https://www.snapeda.com/parts/C0603C104J3RACTU/KEMET/view-part/?ref=eda
C37 = CL21B225KPFNNNG: as C26 on sheet MCU; SnapEDA_Link: https://www.snapeda.com/parts/CL21B225KPFNNNG/Samsung/view-part/?ref=snap; Package: SMD-2 Samsung; Value: *; MP: CL21B225KPFNNNG; Check_prices: https://www.snapeda.com/parts/CL21B225KPFNNNG/Samsung/view-part/?ref=eda
C39 C40 = C0603C200J5GACTU: as C19 on sheet MCU; SnapEDA_Link: https://www.snapeda.com/parts/C0603C200J5GACTU/KEMET/view-part/?ref=snap; Package: 0603 Kemet; Value: *; MF: KEMET; MP: C0603C200J5GACTU; Check_prices: https://www.snapeda.com/parts/C0603C200J5GACTU/KEMET/view-part/?ref=eda
J10 = MTLW-106-06-G-S-180: Package: None; MP: MTLW-106-06-G-S-180; Price: None; Availability: Unavailable; Value: *
R23-R44 = AC1206FR-070RL: as R17 on sheet MCU; SnapEDA_Link: https://www.snapeda.com/parts/AC1206FR-070RL/Yageo/view-part/?ref=snap; Package: SMD-2 Yageo; Value: *; MP: AC1206FR-070RL; Check_prices: https://www.snapeda.com/parts/AC1206FR-070RL/Yageo/view-part/?ref=eda
S3 = TS07-667-43-BK-260-SMT-TR: as S1 on sheet MCU; SnapEDA_Link: https://www.snapeda.com/parts/TS07-667-43-BK-260-SMT-TR/Same+Sky/view-part/?ref=snap; Package: None; Value: *; MP: TS07-667-43-BK-260-SMT-TR; Check_prices: https://www.snapeda.com/parts/TS07-667-43-BK-260-SMT-TR/Same+Sky/view-part/?ref=eda
T1 = H1102NL: - Isolation and Data Interface (Encapsulated) Pulse Transformer 1:1 Transmitter, 1:1 Receiver Surface Mount; SnapEDA_Link: https://www.snapeda.com/parts/H1102NL/Pulse/view-part/?ref=snap; Package: Non Standard Pulse; Value: *; MF: Pulse; MP: H1102NL; Check_prices: https://www.snapeda.com/parts/H1102NL/Pulse/view-part/?ref=eda
U4 = W5500: Hardwired TCP/IP embedded Ethernet controller; Availability: Unavailable; MP: W5500; Value: *; Price: None; Package: None
Y3 = ABM8G-25.000MHZ-18-D2Y-T: 25 MHz Â±20ppm Crystal 18pF 60 Ohms 4-SMD, No Lead; MF: Abracon; Value: *; SnapEDA_Link: https://www.snapeda.com/parts/ABM8G-25.000MHZ-18-D2Y-T/Abracon+LLC/view-part/?ref=snap; Purchase-URL: https://pricing.snapeda.com/search/part/ABM8G-25.000MHZ-18-D2Y-T/?ref=eda; Availability: In Stock; Price: None; Package: SMD-4 Abracon; Check_prices: https://www.snapeda.com/parts/ABM8G-25.000MHZ-18-D2Y-T/Abracon+LLC/view-part/?ref=eda; MP: ABM8G-25.000MHZ-18-D2Y-T

## Nets that join several sheets
3V3: Power section (9 pins), MCU (20 pins), Sheet1 (14 pins)
GND: Power section (35 pins), MCU (31 pins), Sheet1 (26 pins)
PB3: MCU (U2.55), Sheet1 (5 pins)
PB12: MCU (U2.33), Sheet1 (U4.32)
PB13: MCU (U2.34), Sheet1 (U4.33)
PB14: MCU (U2.35), Sheet1 (U4.34)
PB15: MCU (U2.36), Sheet1 (U4.35)